# Altium project ECE315_BenchExam.PrjPCB
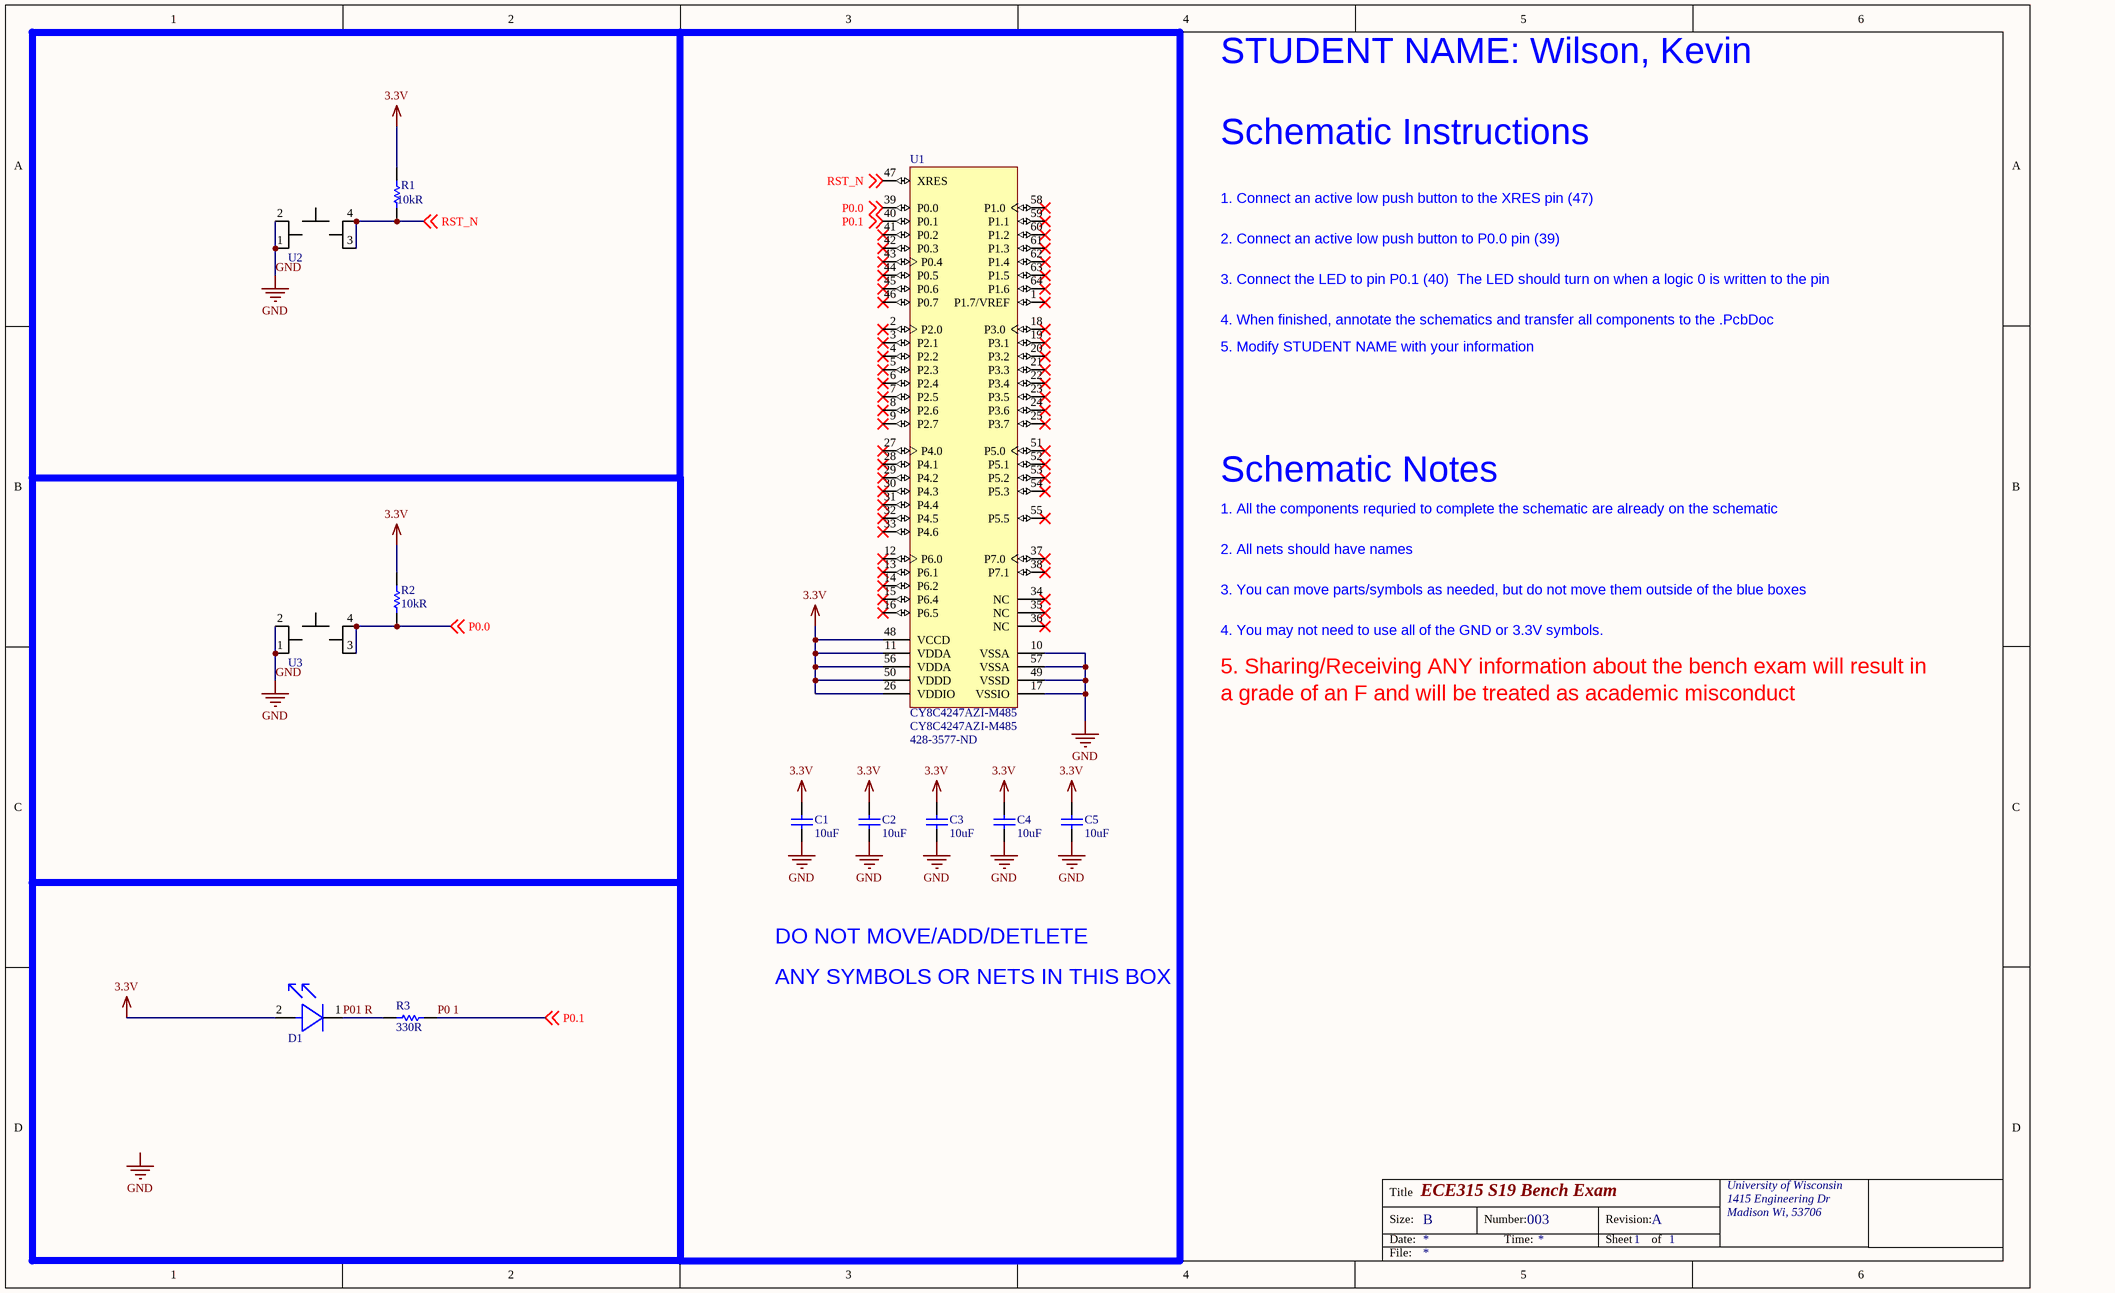
[diagram p0: BenchExam.SchDoc]
1 sheet, 12 parts. Net scope: global (net labels, ports and power ports of the same name join across sheets).
Board file: BenchExam.PcbDoc

## Sheet BenchExam.SchDoc: ECE315 S19 Bench Exam
size B; Organization: University of Wisconsin; Address1: 1415 Engineering Dr; Address2: Madison Wi, 53706; DocumentNumber: 003; Revision: A; SheetNumber: 1; SheetTotal: 1

### Parts
C1  10uF  [CAP_0805]
C2  10uF  [CAP_0805]
C3  10uF  [CAP_0805]
C4  10uF  [CAP_0805]
C5  10uF  [CAP_0805]
D1  LED_BLUE_0805.1  [LED_BLU_0805]  (value not drawn)
R1  Resistance: 10kR  [RES_0805]  (hidden comment: 10K)
R2  Resistance: 10kR  [RES_0805]  (hidden comment: 10K)
R3  Resistance: 330R  [RES_0805]  (hidden comment: 330)
U1  CY8C4247AZI-M485  Supplier Part Number: 428-3577-ND  [CYP-AZ64_N]
U2  SWITCH_6mm_6mm_smd  [SWITCH_6mm_6mm_smd]  (value not drawn)
U3  SWITCH_6mm_6mm_smd  [SWITCH_6mm_6mm_smd]  (value not drawn)

### Nets
3.3V: C1.2 C2.2 C3.2 C4.2 C5.2 D1.2(Anode) R1.1 R2.2 U1.11(VDDA) U1.26(VDDIO) U1.48(VCCD) U1.50(VDDD) U1.56(VDDA)
GND: C1.1 C2.1 C3.1 C4.1 C5.1 U1.10(VSSA) U1.17(VSSIO) U1.49(VSSD) U1.57(VSSA) U2.1 U2.2 U3.1 U3.2
P0 1: R3.2 U1.40(P0.1) ; off-sheet P0.1  [also labelled P0.1]
P0.0: R2.1 U1.39(P0.0) U3.3 U3.4(VCCIO) ; off-sheet P0.0
P01 R: D1.1(Cathode) R3.1
RST_N: R1.2 U1.47(XRES) U2.3 U2.4(VCCIO) ; off-sheet RST_N

Not connected (* = marked no-connect by the designer): U1 1(P1.7/VREF)* 2(P2.0)* 3(P2.1)* 4(P2.2)* 5(P2.3)* 6(P2.4)* 7(P2.5)* 8(P2.6)* 9(P2.7)* 12(P6.0)* 13(P6.1)* 14(P6.2)* 15(P6.4)* 16(P6.5)* 18(P3.0)* 19(P3.1)* 20(P3.2)* 21(P3.3)* 22(P3.4)* 23(P3.5)* 24(P3.6)* 25(P3.7)* 27(P4.0)* 28(P4.1)* 29(P4.2)* 30(P4.3)* 31(P4.4)* 32(P4.5)* 33(P4.6)* 34(NC)* 35(NC)* 36(NC)* 37(P7.0)* 38(P7.1)* 41(P0.2)* 42(P0.3)* 43(P0.4)* 44(P0.5)* 45(P0.6)* 46(P0.7)* 51(P5.0)* 52(P5.1)* 53(P5.2)* 54(P5.3)* 55(P5.5)* 58(P1.0)* 59(P1.1)* 60(P1.2)* 61(P1.3)* 62(P1.4)* 63(P1.5)* 64(P1.6)*

### Notes on the sheet
- STUDENT NAME: Wilson, Kevin
- Schematic Instructions
- 1. Connect an active low push button to the XRES pin (47)
- 2. Connect an active low push button to P0.0 pin (39)
- 3. Connect the LED to pin P0.1 (40)  The LED should turn on when a logic 0 is written to the pin
- 4. When finished, annotate the schematics and transfer all components to the .PcbDoc
- 5. Modify STUDENT NAME with your information
- Schematic Notes
- 1. All the components requried to complete the schematic are already on the schematic
- 2. All nets should have names
- 3. You can move parts/symbols as needed, but do not move them outside of the blue boxes
- 4. You may not need to use all of the GND or 3.3V symbols.
- 5. Sharing/Receiving ANY information about the bench exam will result in
- a grade of an F and will be treated as academic misconduct
- DO NOT MOVE/ADD/DETLETE
- ANY SYMBOLS OR NETS IN THIS BOX
- Labels drawn without touching a wire or pin: GND
- Title
- Size:
- Date:
- B
- Number:
- Time:
- Revision:
- Sheet
- of
- File:

### Library data of the parts
C1-C5 = CAP_0805_U_010.00: CAP CER 10UF 16V X7R 0805; Manufacturer: Samsung; Manufacturer Part Number: CL21A106KPCLQNC; Tolerance: 10%; Dielectric: X5R; Voltage Rating: 10V; ComponentLink3URL: https://datasheet.ciiva.com/26920/getdatasheetpartid-355170-26920201.pdf; ComponentLink3Description: https://datasheet.ciiva.com/26920/getdatasheetpartid-355170-26920201.pdf; ComponentLink1URL: https://datasheet.ciiva.com/25730/cl21a106kpclqnc-25730594.pdf; ComponentLink1Description: https://datasheet.ciiva.com/25730/cl21a106kpclqnc-25730594.pdf; Supplier: Digi-Key; Length: 2mm; Case Code (Metric): 2012; Max Operating Temperature: 85°C; Mount: Surface Mount; Thickness: 0.037inch; Contact Plating: Tin; Radiation Hardening: No; Case/Package: 0805; Min Operating Temperature: -55°C; Packaging: Tape and Reel; Width: 0.049inch; Package Quantity: 1; Depth: 1.25mm; Height: 0.85mm; Case Code (Imperial): 0805; Supplier Part Number: 1276-2402-1-ND; Capacitance: 10uF
D1 = LED_BLUE_0805.1: LED 468NM BLUE CLEAR 0805 SMD; Manufacturer: Vishay Lite-On; Manufacturer Part Number: LTST-C171TBKT; Viewing Angle: 130°; Test Current: 20mA; Lens Style: Diffused,Colorless,Rectangular,Clear; Lens Color: Colorless,Clear; Number of LEDs: 1; Reverse Voltage: 5V; Luminous Intensity: 180mcd; Forward Voltage: 3.8V; Power Dissipation: 76mW; Dominant Wavelength: 475nm; ComponentLink1URL: https://datasheet.ciiva.com/2110/ltst-c171tbkt-2110304.pdf; ComponentLink1Description: https://datasheet.ciiva.com/2110/ltst-c171tbkt-2110304.pdf; ComponentLink2URL: https://datasheet.ciiva.com/2110/s-110-ltst-c171tbkt0630-2110305.pdf; ComponentLink2Description: https://datasheet.ciiva.com/2110/s-110-ltst-c171tbkt0630-2110305.pdf; ComponentLink3URL: https://datasheet.ciiva.com/11774/0900766b80dc029b-11774836.pdf; ComponentLink3Description: https://datasheet.ciiva.com/11774/0900766b80dc029b-11774836.pdf; ComponentLink4URL: https://datasheet.ciiva.com/12403/lite-on-ltst-c171tbkt-187246-12403800.pdf; ComponentLink4Description: https://datasheet.ciiva.com/12403/lite-on-ltst-c171tbkt-187246-12403800.pdf; ComponentLink5URL: https://datasheet.ciiva.com/15118/getdatasheetpartid-225754-15118121.pdf; ComponentLink5Description: https://datasheet.ciiva.com/15118/getdatasheetpartid-225754-15118121.pdf; ComponentLink6URL: https://datasheet.ciiva.com/16444/lite-onltst-c171tbkt-16444780.pdf; ComponentLink6Description: https://datasheet.ciiva.com/16444/lite-onltst-c171tbkt-16444780.pdf; Wavelength: 468nm; Lens Transparency: Clear; Case Code (Imperial): 0805; Min Operating Temperature: -20°C; Color: Blue; Max Operating Temperature: 80°C; Number of Pins: 2; Packaging: Tape and Reel; Width: 1.25mm; Depth: 1.25mm; Height: 0.8mm; Package Quantity: 1; Supplier: Digi-Key; Number of Elements: 1; Case/Package: 0805; Length: 2mm; Radiation Hardening: No; Forward Current: 20mA; Mount: Surface Mount; Illumination Color: Blue; Lead Free: Lead Free; Case Code (Metric): 2012; Supplier Part Number: 160-1645-1-ND
R1 R2 = RES_0805_K_010.00: RES SMD 10K OHM 1% 1/8W 0805; Manufacturer Part Number: RMCF0805FT10K0; Manufacturer: Stackpole Electronics; Temperature Coefficient: 100ppm/°C; Max Power Dissipation: 125mW; ComponentLink1URL: https://datasheet.ciiva.com/11808/0900766b80f80784-11808080.pdf; ComponentLink1Description: https://datasheet.ciiva.com/11808/0900766b80f80784-11808080.pdf; ComponentLink2URL: https://datasheet.ciiva.com/16514/aoa0000ce2-16514021.pdf; ComponentLink2Description: https://datasheet.ciiva.com/16514/aoa0000ce2-16514021.pdf; ComponentLink3URL: https://datasheet.ciiva.com/27055/1988971-27055733.pdf; ComponentLink3Description: https://datasheet.ciiva.com/27055/1988971-27055733.pdf; ComponentLink4URL: https://datasheet.ciiva.com/16759/70260748-16759350.pdf; ComponentLink4Description: https://datasheet.ciiva.com/16759/70260748-16759350.pdf; ComponentLink5URL: https://datasheet.ciiva.com/16725/70260748-16725031.pdf; ComponentLink5Description: https://datasheet.ciiva.com/16725/70260748-16725031.pdf; ComponentLink6URL: https://datasheet.ciiva.com/7830/426256-7830745.pdf; ComponentLink6Description: https://datasheet.ciiva.com/7830/426256-7830745.pdf; ComponentLink7URL: https://datasheet.ciiva.com/46372/1678782-46372714.pdf; ComponentLink7Description: https://datasheet.ciiva.com/46372/1678782-46372714.pdf; ComponentLink8URL: https://datasheet.ciiva.com/46372/1678782-46372715.pdf; ComponentLink8Description: https://datasheet.ciiva.com/46372/1678782-46372715.pdf; ComponentLink9URL: https://datasheet.ciiva.com/17212/aoa0000ce2-17212108.pdf; ComponentLink9Description: https://datasheet.ciiva.com/17212/aoa0000ce2-17212108.pdf; ComponentLink10URL: https://datasheet.ciiva.com/30140/aoa0000ce2-30140236.pdf; ComponentLink10Description: https://datasheet.ciiva.com/30140/aoa0000ce2-30140236.pdf; ComponentLink11URL: https://datasheet.ciiva.com/16740/aoa0000ce2-16740669.pdf; ComponentLink11Description: https://datasheet.ciiva.com/16740/aoa0000ce2-16740669.pdf; ComponentLink12URL: https://datasheet.ciiva.com/24070/aoa0000ce2-24070702.pdf; ComponentLink12Description: https://datasheet.ciiva.com/24070/aoa0000ce2-24070702.pdf; Width: 0.049inch; Height: 0.026inch; Features: Automotive AEC-Q200; Min Operating Temperature: -55°C; Case/Package: 0805; Mount: Surface Mount; Composition: Thick Film; Length: 2mm; Lead Free: Lead Free; Max Operating Temperature: 155°C; Tolerance: 1%; Case Code (Metric): 2012; Military Standard: Not; Radiation Hardening: No; Depth: 1.25mm; Number of Terminations: 2; Power Rating: 125mW; Contact Plating: Tin,Matte; Supplier: Digi-Key; Packaging: Tape and Reel; Case Code (Imperial): 0805; Supplier Part Number: RMCF0805FT10K0CT-ND
R3 = RES_0805_R_330.00: RES SMD 330 OHM 1% 1/8W 0805; Manufacturer: Stackpole Electronics; Manufacturer Part Number: RMCF0805FT330R; Max Power Dissipation: 125mW; Temperature Coefficient: 100ppm/°C; ComponentLink1URL: https://datasheet.ciiva.com/11821/0900766b80f80784-11821635.pdf; ComponentLink1Description: https://datasheet.ciiva.com/11821/0900766b80f80784-11821635.pdf; ComponentLink2URL: https://datasheet.ciiva.com/30131/aoa0000ce2-30131349.pdf; ComponentLink2Description: https://datasheet.ciiva.com/30131/aoa0000ce2-30131349.pdf; ComponentLink3URL: https://datasheet.ciiva.com/24025/aoa0000ce2-24025991.pdf; ComponentLink3Description: https://datasheet.ciiva.com/24025/aoa0000ce2-24025991.pdf; ComponentLink4URL: https://datasheet.ciiva.com/17206/aoa0000ce2-17206152.pdf; ComponentLink4Description: https://datasheet.ciiva.com/17206/aoa0000ce2-17206152.pdf; ComponentLink5URL: https://datasheet.ciiva.com/46436/1678782-46436633.pdf; ComponentLink5Description: https://datasheet.ciiva.com/46436/1678782-46436633.pdf; ComponentLink6URL: https://datasheet.ciiva.com/46436/1678782-46436634.pdf; ComponentLink6Description: https://datasheet.ciiva.com/46436/1678782-46436634.pdf; ComponentLink7URL: https://datasheet.ciiva.com/16760/70260748-16760668.pdf; ComponentLink7Description: https://datasheet.ciiva.com/16760/70260748-16760668.pdf; ComponentLink8URL: https://datasheet.ciiva.com/16780/70260748-16780764.pdf; ComponentLink8Description: https://datasheet.ciiva.com/16780/70260748-16780764.pdf; ComponentLink9URL: https://datasheet.ciiva.com/22684/1678782-22684798.pdf; ComponentLink9Description: https://datasheet.ciiva.com/22684/1678782-22684798.pdf; ComponentLink10URL: https://datasheet.ciiva.com/28590/1678782-28590783.pdf; ComponentLink10Description: https://datasheet.ciiva.com/28590/1678782-28590783.pdf; Radiation Hardening: No; Height: 0.026inch; Lead Free: Lead Free; Case/Package: 0805; Supplier: Digi-Key; Min Operating Temperature: -55°C; Mount: Surface Mount; Composition: Thick Film; Max Operating Temperature: 155°C; Contact Plating: Tin,Matte; Case Code (Metric): 2012; Length: 0.079inch; Width: 0.049inch; Military Standard: Not; Number of Terminations: 2; Features: Automotive AEC-Q200; Packaging: Tape and Reel; Case Code (Imperial): 0805; Depth: 1.25mm; Tolerance: 1%; Supplier Part Number: RMCF0805FT330RCT-ND
U1 = CY8C4247AZI-M485: Programmable System-on-Chip (PSoC®), 128 KB Flash, 51 GPIOs, 1.71 to 5.5 V, 64-Pin TQFP (AZ64), Tray; Manufacturer: Cypress; Flash (KB): 128; No. of GPIOs: 51; Max. Operating Voltage (V): 5.5; SRAM (KB): 16; Min. Operating Voltage (V): 1.71; Max. Operating Frequency (MHz): 48; No. of Op Amps: 4; CPU Core: ARM Cortex-M0; Section: 002; Oscillator Type: Internal; Interface: I2C,SPI,CAN,IrDA,SSP,UART,USART,LIN; RAM Size: 16KB; Peripherals: Brown-out Detect/Reset,POR,PWM,WDT,LVD,LCD; Max Frequency: 48MHz; Core Architecture: ARM; Number of Timers/Counters: 8; Watchdog Timer: Yes; Min Supply Voltage: 1.71V; Max Supply Voltage: 5.5V; Memory Size: 128KB; PartNumber: CY8C4247AZI-M485; Max. Operating Temp. (degreesC): 85; ComponentLink1Description: Manufacturer URL; ComponentLink2Description: Datasheet; DatasheetVersion: Rev. *D; ComponentLink3URL: http://www.cypress.com/file/129016/download; ComponentLink1URL: http://www.cypress.com/; Packing: Tray; ComponentLink2URL: http://www.cypress.com/file/139956/download; PackageReference: AZ64; ComponentLink3Description: Package Specification; PackageVersion: Rev. *B, 01/2010; RoHS: Pb-Free; Min. Operating Temp. (degreesC): -40; Mounting Technology: Surface Mount; PackageDescription: 64-Pin Thin Plastic Quad Flatpack, Body 10 x 10 mm, Pitch 0.5 mm; REACH SVHC: No SVHC; Lead Free: Lead Free; Memory Type: FLASH; Number of Pins: 64; Case/Package: TQFP; Mount: Surface Mount; Min Operating Temperature: -40°C; Number of Programmable I/O: 51; Contact Plating: Gold; Max Operating Temperature: 85°C; Supplier: Digi-Key; Frequency: 48MHz; Number of I/Os: 51; Packaging: Tray; Manufacturer Part Number: CY8C4247AZI-M485
U2 U3 = SWITCH_6mm_6mm_smd: SWITCH TACTILE SPST-NO 0.05A 12V; Manufacturer: Carl Kammerling; Manufacturer Part Number: PTS645SH50SMTR92LFS; Supplier Part Number: CKN9085CT-ND; Supplier: Digi-Key